# Altium schematic sheet micron_P4.SchDoc
size A; SheetNumber: 4; SheetTotal: 11
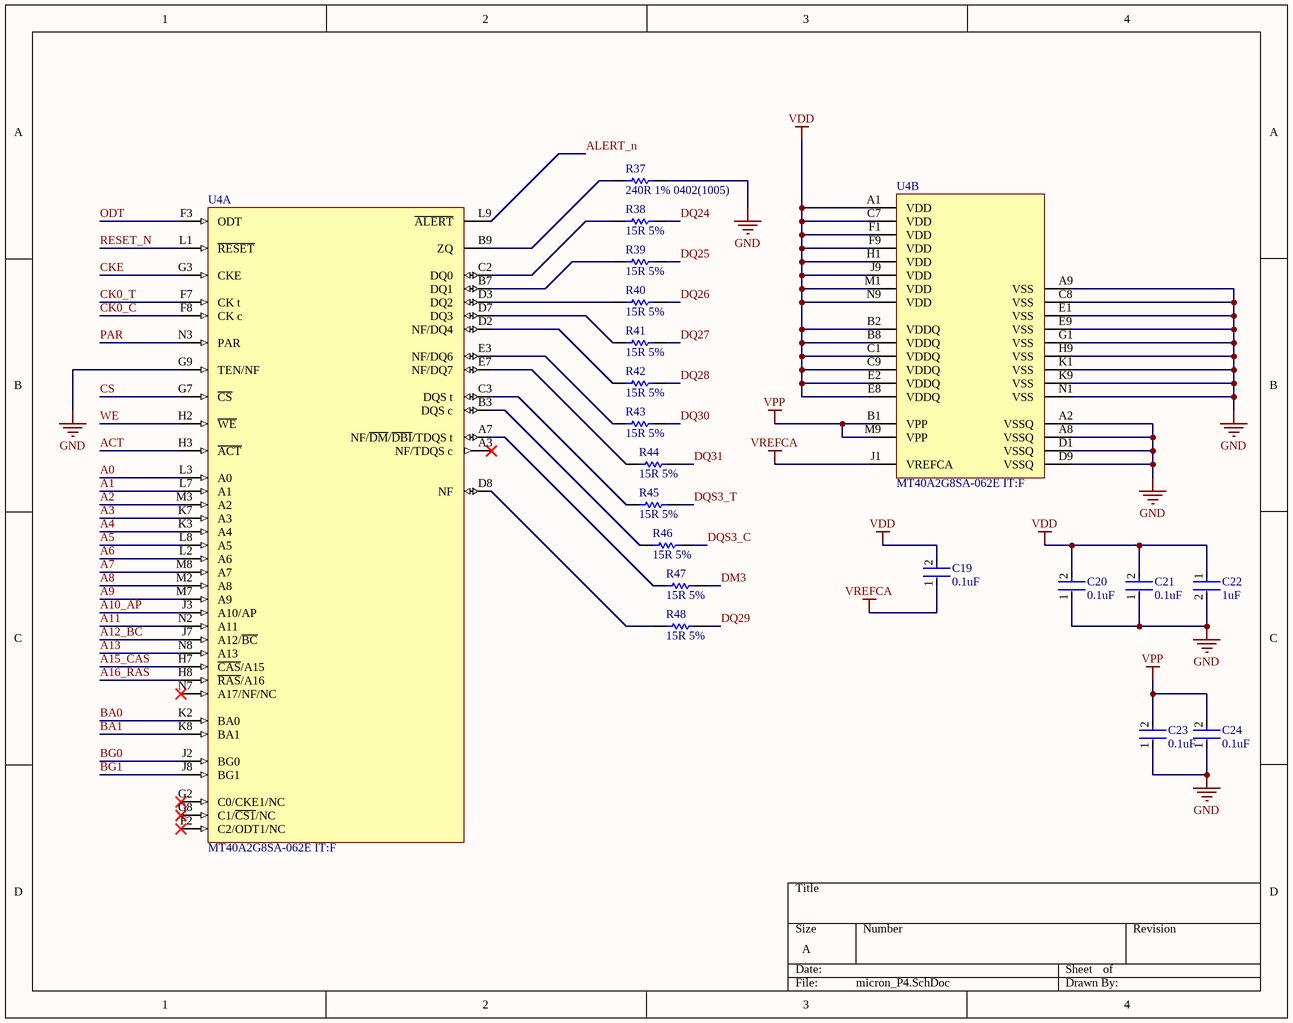
[diagram p0: micron_P4.SchDoc]

## Parts
C19  0.1uF  [FP-GRM15-MFG]
C20  0.1uF  [FP-GRM15-MFG]
C21  0.1uF  [FP-GRM15-MFG]
C22  1uF  [FP-CL511-IPC_C]
C23  0.1uF  [FP-GRM15-MFG]
C24  0.1uF  [FP-GRM15-MFG]
R37  240R 1% 0402(1005)  [RESC0402(1005)_L]
R38  15R 5%  [RESC1005X40X25LL05T10]
R39  15R 5%  [RESC1005X40X25LL05T10]
R40  15R 5%  [RESC1005X40X25LL05T10]
R41  15R 5%  [RESC1005X40X25LL05T10]
R42  15R 5%  [RESC1005X40X25LL05T10]
R43  15R 5%  [RESC1005X40X25LL05T10]
R44  15R 5%  [RESC1005X40X25LL05T10]
R45  15R 5%  [RESC1005X40X25LL05T10]
R46  15R 5%  [RESC1005X40X25LL05T10]
R47  15R 5%  [RESC1005X40X25LL05T10]
R48  15R 5%  [RESC1005X40X25LL05T10]
U4  MT40A2G8SA-062E IT:F  [SA_MFG]  (parts A,B of 2)

## Nets
GND: C20.1 C21.1 C22.2 C23.1 C24.1 R37.2 U4.A2(VSSQ) U4.A8(VSSQ) U4.A9(VSS) U4.C8(VSS) U4.D1(VSSQ) U4.D9(VSSQ) U4.E1(VSS) U4.E9(VSS) U4.G1(VSS) U4.G9(TEN/NF) U4.H9(VSS) U4.K1(VSS) U4.K9(VSS) U4.N1(VSS)
VDD: C19.2 C20.2 C21.2 C22.1 U4.A1(VDD) U4.B2(VDDQ) U4.B8(VDDQ) U4.C1(VDDQ) U4.C7(VDD) U4.C9(VDDQ) U4.E2(VDDQ) U4.E8(VDDQ) U4.F1(VDD) U4.F9(VDD) U4.H1(VDD) U4.J9(VDD) U4.M1(VDD) U4.N9(VDD)
VPP: C23.2 C24.2 U4.B1(VPP) U4.M9(VPP)
VREFCA: C19.1 U4.J1(VREFCA)
A0: U4.L3(A0)
A1: U4.L7(A1)
A2: U4.M3(A2)
A3: U4.K7(A3)
A4: U4.K3(A4)
A5: U4.L8(A5)
A6: U4.L2(A6)
A7: U4.M8(A7)
A8: U4.M2(A8)
A9: U4.M7(A9)
A10_AP: U4.J3(A10/AP)
A11: U4.N2(A11)
A12_BC: U4.J7(A12/~{BC})
A13: U4.N8(A13)
A15_CAS: U4.H7(~{CAS}/A15)
A16_RAS: U4.H8(~{RAS}/A16)
ACT: U4.H3(~{ACT})
ALERT_n: U4.L9(~{ALERT})
BA0: U4.K2(BA0)
BA1: U4.K8(BA1)
BG0: U4.J2(BG0)
BG1: U4.J8(BG1)
CK0_C: U4.F8(CK_c)
CK0_T: U4.F7(CK_t)
CKE: U4.G3(CKE)
CS: U4.G7(~{CS})
DM3: R47.2
DQ24: R38.2
DQ25: R39.2
DQ26: R40.2
DQ27: R41.2
DQ28: R42.2
DQ29: R48.2
DQ30: R43.2
DQ31: R44.2
DQS3_C: R46.2
DQS3_T: R45.2
ODT: U4.F3(ODT)
PAR: U4.N3(PAR)
RESET_N: U4.L1(~{RESET})
WE: U4.H2(~{WE})
NetR37_1: R37.1 U4.B9(ZQ)
NetR38_1: R38.1 U4.C2(DQ0)
NetR39_1: R39.1 U4.B7(DQ1)
NetR40_1: R40.1 U4.D3(DQ2)
NetR41_1: R41.1 U4.D7(DQ3)
NetR42_1: R42.1 U4.D2(NF/DQ4)
NetR43_1: R43.1 U4.E3(NF/DQ6)
NetR44_1: R44.1 U4.E7(NF/DQ7)
NetR45_1: R45.1 U4.C3(DQS_t)
NetR46_1: R46.1 U4.B3(DQS_c)
NetR47_1: R47.1 U4.A7(NF/~{DM}/~{DBI}/TDQS_t)
NetR48_1: R48.1 U4.D8(NF)

Not connected (* = marked no-connect by the designer): U4 A3(NF/TDQS_c)* F2(C2/ODT1/NC)* G2(C0/CKE1/NC)* G8(C1/~{CS1}/NC)* N7(A17/NF/NC)*

## Library data of the parts
C19-C21 C23 C24 = CMP-2100-03641-2: CAP CER 0.1UF 16V X7R 0402; Manufacturer Part Number: GRM155R71C104KA88D; Manufacturer: Murata; Standoff Height: 0mm; Tolerance: 10%; Voltage Rating: 16Vdc; Material: Ceramic; Capacitance: 0.10μF; Value: 0.10μF; RoHS: TRUE; Temperature Characteristic: X7R; Octopart: https://octopart.com/grm155r71c104ka88d-murata-196880; Digikey Description: CAP CER 0.1UF 16V X7R 0402; Device Class L3: Ceramic Capacitors; Height: 0.55mm; ComponentLink2Description: Datasheet; Temperature Range Low: -55°C; Ipc Land Pattern Name: CAPC10050X219; ComponentLink2URL: https://search.murata.co.jp/Ceramy/image/img/A01X/G101/ENG/GRM155R71H471KA01-01A.pdf; Device Class L1: Passive Components; Lead Free: yes; Category: Cap; Package: GRM15; Temperature: -55°C to +125°C; Device Class L2: Capacitors; Temperature Range High: +125°C; Mouser Description: 0402 0.1 uF 16V ±10 % Tolerance X7R SMT Multilayer Ceramic Capacitor
C22 = CMP-13271-001936-1: Cap Ceramic 1uF 10V X5R ±10% SMD 0402 +85°C Paper T/R; Depth: 0.5mm; Case Code (Imperial): 0402; Material: Ceramic; Mount: Surface Mount; Thickness: 0.022inch; Dielectric: X5R; Capacitance: 1uF; Radiation Hardening: No; Case/Package: 0402; Length: 1mm; Tolerance: 10%; Max Operating Temperature: 85°C; Package Quantity: 1; Width: 0.02inch; Voltage Rating: 10V; Contact Plating: Tin; Height: 0.5mm; Min Operating Temperature: -55°C; Case Code (Metric): 1005; Packaging: Tape and Reel
R37 = CMP-1011-00438-1: 240R 0.063W 1% 0402 (1005 Metric)  SMD; Case-Metric: 1005; Case-EIA: 0402; Value: 240.00 Ohm; Power: 0.063 W; Tolerance: 1 %; Technology: SMT
R38-R48 = CMP-2002-07413-1: Manufacturer: Yageo / Phycomp; Part Number: RC0402FR-0715RL
U4 = CMP-00526-125391410-1: DRAMChip DDR4 SDRAM 16Gbit 2Gx8 1.2V 78-Pin FBGA Tray; ComponentLink1URL: http://www.micron.com/; ComponentLink3Description: Manufacturer's Package Drawing; ComponentLink2Description: Datasheet URL; ComponentLink1Description: Manufacturer's Website; ComponentLink3URL: https://www.micron.com/content/dam/micron/global/public/products/customer-service-note/csn33-bga-user-guide.pdf; HelpURL: https://4donline.ihs.com/images/VipMasterIC/IC/MICT/MICT-S-A0014105731/MICT-S-A0014105731-1.pdf?hkey=6D3A4C79FDBF58556ACFDE234799DDF0; ComponentLink2URL: https://4donline.ihs.com/images/VipMasterIC/IC/MICT/MICT-S-A0014105731/MICT-S-A0014105731-1.pdf?hkey=6D3A4C79FDBF58556ACFDE234799DDF0